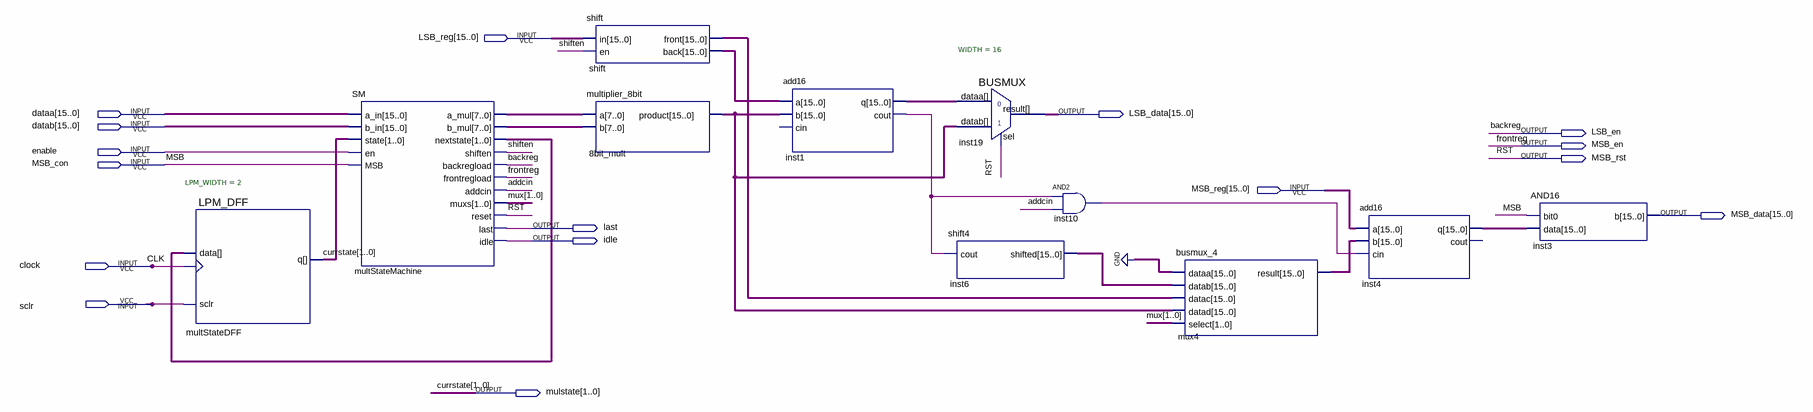
[diagram p0: schematic sheet]
// Quartus schematic loop_mul.bdf as structural Verilog: 11 symbols, 16 pins
module loop_mul (
  input  [15:0] LSB_reg,
  input  [15:0] dataa,
  input  [15:0] datab,
  input  enable,
  input  MSB_con,
  input  [15:0] MSB_reg,
  input  clock,
  input  sclr,
  output [15:0] LSB_data,
  output LSB_en,
  output MSB_en,
  output MSB_rst,
  output [15:0] MSB_data,
  output last,
  output idle,
  output [1:0] mulstate
);

  wire addcin, inst1_cout, inst10_out, shiften;
  wire [1:0] multStateMachine_nextstate, mux;
  wire [7:0] multStateMachine_a_mul, multStateMachine_b_mul;
  wire [15:0] inst1_q, inst4_q, inst6_shifted, mux4_result, n8bit_mult_product, shift_back, shift_front;

  LPM_DFF #(.LPM_WIDTH(2)) multStateDFF (.clock(clock), .data(multStateMachine_nextstate), .sclr(sclr), .q(mulstate));
  SM multStateMachine (
    .a_in(dataa), .b_in(datab), .state(mulstate), .en(enable), .MSB(MSB_con), .a_mul(multStateMachine_a_mul),
    .b_mul(multStateMachine_b_mul), .nextstate(multStateMachine_nextstate), .shiften(shiften),
    .backregload(LSB_en), .frontregload(MSB_en), .addcin(addcin), .muxs(mux), .reset(MSB_rst), .last(last),
    .idle(idle));
  shift shift (.in(LSB_reg), .en(shiften), .front(shift_front), .back(shift_back));
  multiplier_8bit u_8bit_mult (.a(multStateMachine_a_mul), .b(multStateMachine_b_mul), .product(n8bit_mult_product));
  add16 inst1 (.a(shift_back), .b(n8bit_mult_product), .q(inst1_q), .cout(inst1_cout));  // open: cin
  BUSMUX #(.WIDTH(16)) inst19 (.datab(n8bit_mult_product), .sel(MSB_rst), .dataa(inst1_q), .result(LSB_data));
  shift4 inst6 (.cout(inst1_cout), .shifted(inst6_shifted));
  and inst10 (inst10_out, inst1_cout, addcin);
  busmux_4 mux4 (
    .dataa({16{1'b0}}), .datab(inst6_shifted), .datac(shift_front), .datad(n8bit_mult_product), .select(mux),
    .result(mux4_result));
  add16 inst4 (.a(MSB_reg), .b(mux4_result), .cin(inst10_out), .q(inst4_q));  // open: cout
  AND16 inst3 (.bit0(MSB_con), .data(inst4_q), .b(MSB_data));

  // Other names for the same wires on the sheet: backreg = LSB_en; CLK = clock; currstate[1:0] = mulstate;
  //   frontreg = MSB_en; MSB = MSB_con; RST = MSB_rst
endmodule
